# EAGLE schematic FP6120 (EAGLE 6.6.0)

## Sheet 1 of 3
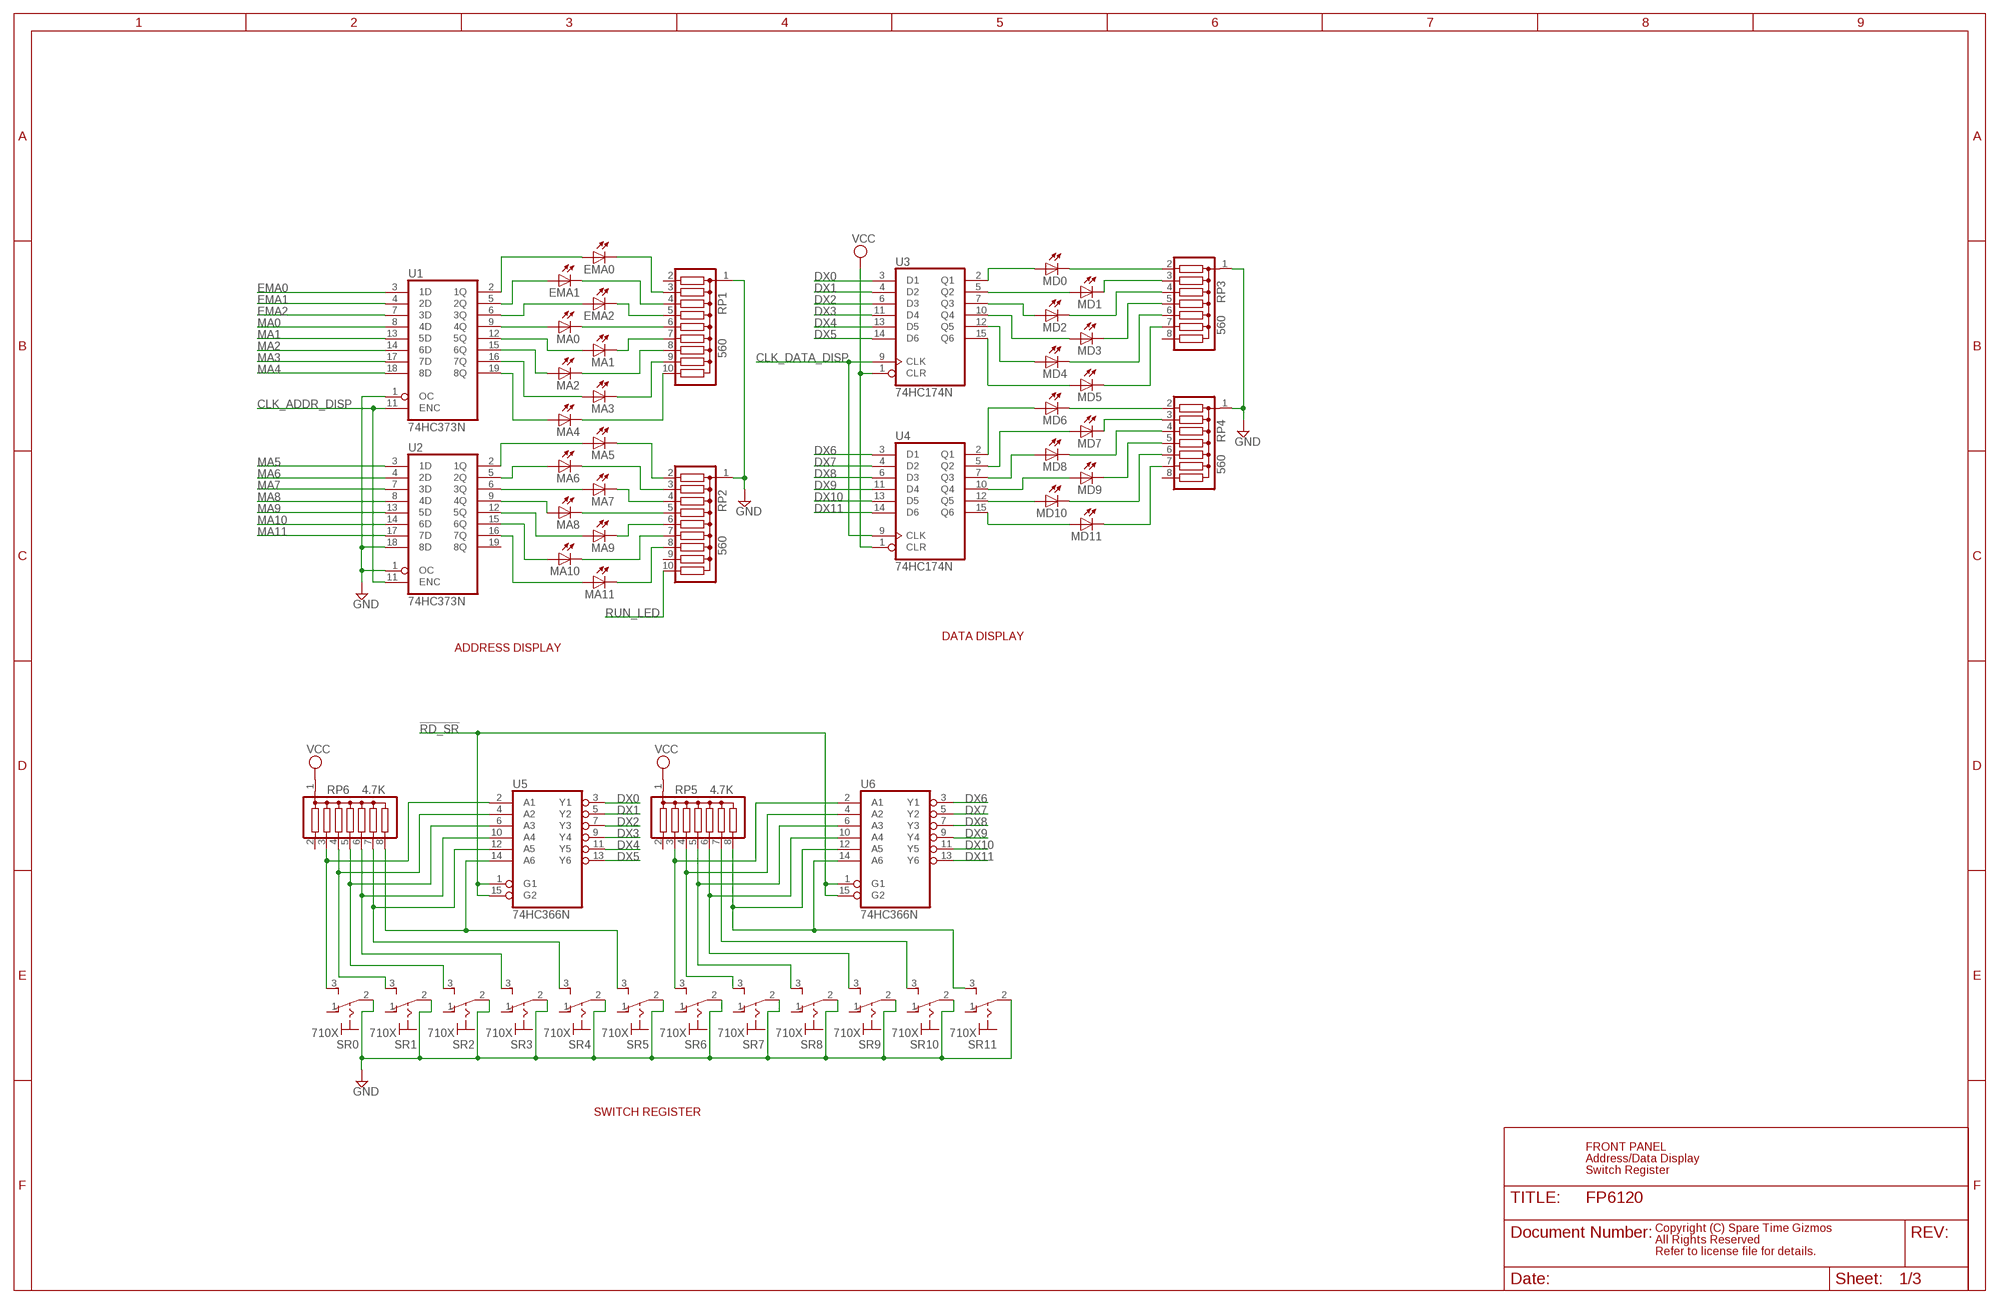
[diagram p0: schematic, sheet 1]

### Parts
EMA0  LED5MM  [LED5MM]
EMA1  LED5MM  [LED5MM]
EMA2  LED5MM  [LED5MM]
MA0  LED5MM  [LED5MM]
MA1  LED5MM  [LED5MM]
MA2  LED5MM  [LED5MM]
MA3  LED5MM  [LED5MM]
MA4  LED5MM  [LED5MM]
MA5  LED5MM  [LED5MM]
MA6  LED5MM  [LED5MM]
MA7  LED5MM  [LED5MM]
MA8  LED5MM  [LED5MM]
MA9  LED5MM  [LED5MM]
MA10  LED5MM  [LED5MM]
MA11  LED5MM  [LED5MM]
MD0  LED5MM  [LED5MM]
MD1  LED5MM  [LED5MM]
MD2  LED5MM  [LED5MM]
MD3  LED5MM  [LED5MM]
MD4  LED5MM  [LED5MM]
MD5  LED5MM  [LED5MM]
MD6  LED5MM  [LED5MM]
MD7  LED5MM  [LED5MM]
MD8  LED5MM  [LED5MM]
MD9  LED5MM  [LED5MM]
MD10  LED5MM  [LED5MM]
MD11  LED5MM  [LED5MM]
RP1  560  G09R  [SIL10]
RP2  560  G09R  [SIL10]
RP3  560  G07R  [SIL8]
RP4  560  G07R  [SIL8]
RP5  4.7K  G07R  [SIL8]
RP6  4.7K  G07R  [SIL8]
SR0  710X  [7109MD9V3]
SR1  710X  [7109MD9V3]
SR2  710X  [7109MD9V3]
SR3  710X  [7109MD9V3]
SR4  710X  [7109MD9V3]
SR5  710X  [7109MD9V3]
SR6  710X  [7109MD9V3]
SR7  710X  [7109MD9V3]
SR8  710X  [7109MD9V3]
SR9  710X  [7109MD9V3]
SR10  710X  [7109MD9V3]
SR11  710X  [7109MD9V3]
U1  74HC373N  74LS373N  [DIL20]
U2  74HC373N  74LS373N  [DIL20]
U3  74HC174N  74LS174N  [DIL16]
U4  74HC174N  74LS174N  [DIL16]
U5  74HC366N  74LS366N  [DIL16]
U6  74HC366N  74LS366N  [DIL16]

### Nets
!RD_SR: U5.1(G1) U5.15(G2) U6.1(G1) U6.15(G2) ; also sheet 3
CLK_ADDR_DISP: U1.11(ENC) U2.11(ENC) ; also sheet 2
CLK_DATA_DISP: U3.9(CLK) U4.9(CLK) ; also sheet 2
DX0: U3.3(D1) U5.3(Y1) ; also sheet 2,3
DX1: U3.4(D2) U5.5(Y2) ; also sheet 2,3
DX2: U3.6(D3) U5.7(Y3) ; also sheet 2,3
DX3: U3.11(D4) U5.9(Y4) ; also sheet 2,3
DX4: U3.13(D5) U5.11(Y5) ; also sheet 2,3
DX5: U3.14(D6) U5.13(Y6) ; also sheet 2,3
DX6: U4.3(D1) U6.3(Y1) ; also sheet 2,3
DX7: U4.4(D2) U6.5(Y2) ; also sheet 2,3
DX8: U4.6(D3) U6.7(Y3) ; also sheet 2,3
DX9: U4.11(D4) U6.9(Y4) ; also sheet 2,3
DX10: U4.13(D5) U6.11(Y5) ; also sheet 2,3
DX11: U4.14(D6) U6.13(Y6) ; also sheet 2,3
EMA0: U1.3(1D) ; also sheet 3
EMA1: U1.4(2D) ; also sheet 3
EMA2: U1.7(3D) ; also sheet 3
GND: RP1.1 RP2.1 RP3.1 RP4.1 SR0.2(P) SR1.2(P) SR2.2(P) SR3.2(P) SR4.2(P) SR5.2(P) SR6.2(P) SR7.2(P) SR8.2(P) SR9.2(P) SR10.2(P) SR11.2(P) U1.1(OC) U2.1(OC) U2.18(8D) ; also sheet 2,3
MA0: U1.8(4D) ; also sheet 3
MA1: U1.13(5D) ; also sheet 3
MA2: U1.14(6D) ; also sheet 3
MA3: U1.17(7D) ; also sheet 2,3
MA4: U1.18(8D) ; also sheet 2,3
MA5: U2.3(1D) ; also sheet 2,3
MA6: U2.4(2D) ; also sheet 2,3
MA7: U2.7(3D) ; also sheet 2,3
MA8: U2.8(4D) ; also sheet 2,3
MA9: U2.13(5D) ; also sheet 2,3
MA10: U2.14(6D) ; also sheet 2,3
MA11: U2.17(7D) ; also sheet 2,3
N$1: EMA0.A U1.2(1Q)
N$2: MA4.K(C) RP1.10
N$3: EMA1.A U1.5(2Q)
N$4: EMA2.A U1.6(3Q)
N$5: MA0.A U1.9(4Q)
N$6: MA4.A U1.19(8Q)
N$7: MA3.A U1.16(7Q)
N$8: MA2.A U1.15(6Q)
N$9: MA1.A U1.12(5Q)
N$10: MA5.A U2.2(1Q)
N$11: MA6.A U2.5(2Q)
N$12: MA7.A U2.6(3Q)
N$13: MA8.A U2.9(4Q)
N$14: MA11.A U2.16(7Q)
N$15: MA10.A U2.15(6Q)
N$16: MA9.A U2.12(5Q)
N$17: MA3.K(C) RP1.9
N$18: MA2.K(C) RP1.8
N$19: MA1.K(C) RP1.7
N$20: MA0.K(C) RP1.6
N$21: EMA0.K(C) RP1.3
N$22: EMA1.K(C) RP1.4
N$23: EMA2.K(C) RP1.5
N$24: MA11.K(C) RP2.8
N$25: MA10.K(C) RP2.7
N$26: MA9.K(C) RP2.6
N$27: MA8.K(C) RP2.5
N$28: MA7.K(C) RP2.4
N$29: MA6.K(C) RP2.3
N$30: MA5.K(C) RP2.2
N$31: MD10.A U4.12(Q5)
N$32: MD3.A U3.10(Q4)
N$33: MD1.A U3.5(Q2)
N$34: MD5.A U3.15(Q6)
N$35: MD7.A U4.5(Q2)
N$36: MD11.A U4.15(Q6)
N$37: MD9.A U4.10(Q4)
N$38: MD4.K(C) RP3.6
N$39: MD2.K(C) RP3.4
N$40: MD0.K(C) RP3.2
N$41: MD10.K(C) RP4.6
N$42: MD8.K(C) RP4.4
N$43: MD6.K(C) RP4.2
N$44: MD8.A U4.7(Q3)
N$45: MD6.A U4.2(Q1)
N$46: MD4.A U3.12(Q5)
N$47: MD2.A U3.7(Q3)
N$48: RP6.3 SR0.3(S) U5.2(A1)
N$49: MD1.K(C) RP3.3
N$50: MD3.K(C) RP3.5
N$51: MD5.K(C) RP3.7
N$52: MD7.K(C) RP4.3
N$53: MD9.K(C) RP4.5
N$54: RP6.4 SR1.3(S) U5.4(A2)
N$55: MD11.K(C) RP4.7
N$56: RP6.5 SR2.3(S) U5.6(A3)
N$57: RP6.6 SR3.3(S) U5.10(A4)
N$58: RP6.7 SR4.3(S) U5.12(A5)
N$59: RP6.8 SR5.3(S) U5.14(A6)
N$60: RP5.3 SR6.3(S) U6.2(A1)
N$61: RP5.8 SR11.3(S) U6.12(A5) U6.14(A6)
N$62: RP5.7 SR10.3(S)
N$63: RP5.6 SR9.3(S) U6.10(A4)
N$64: RP5.5 SR8.3(S) U6.6(A3)
N$65: RP5.4 SR7.3(S) U6.4(A2)
N$68: MD0.A U3.2(Q1)
RUN_LED: RP2.10 ; also sheet 2
VCC: RP5.1 RP6.1 U3.1(CLR) U4.1(CLR) ; also sheet 2,3
Unconnected: RP1.2 RP2.9 RP3.8 RP4.8 RP5.2 RP6.2 SR0.1(O) SR1.1(O) SR2.1(O) SR3.1(O) SR4.1(O) SR5.1(O) SR6.1(O) SR7.1(O) SR8.1(O) SR9.1(O) SR10.1(O) SR11.1(O) U2.19(8Q)

### Notes on the sheet
- DATA DISPLAY
- ADDRESS DISPLAY
- SWITCH REGISTER
- FRONT PANEL
- Address/Data Display
- Switch Register
- Copyright (C) Spare Time Gizmos
- All Rights Reserved
- Refer to license file for details.

## Sheet 2 of 3
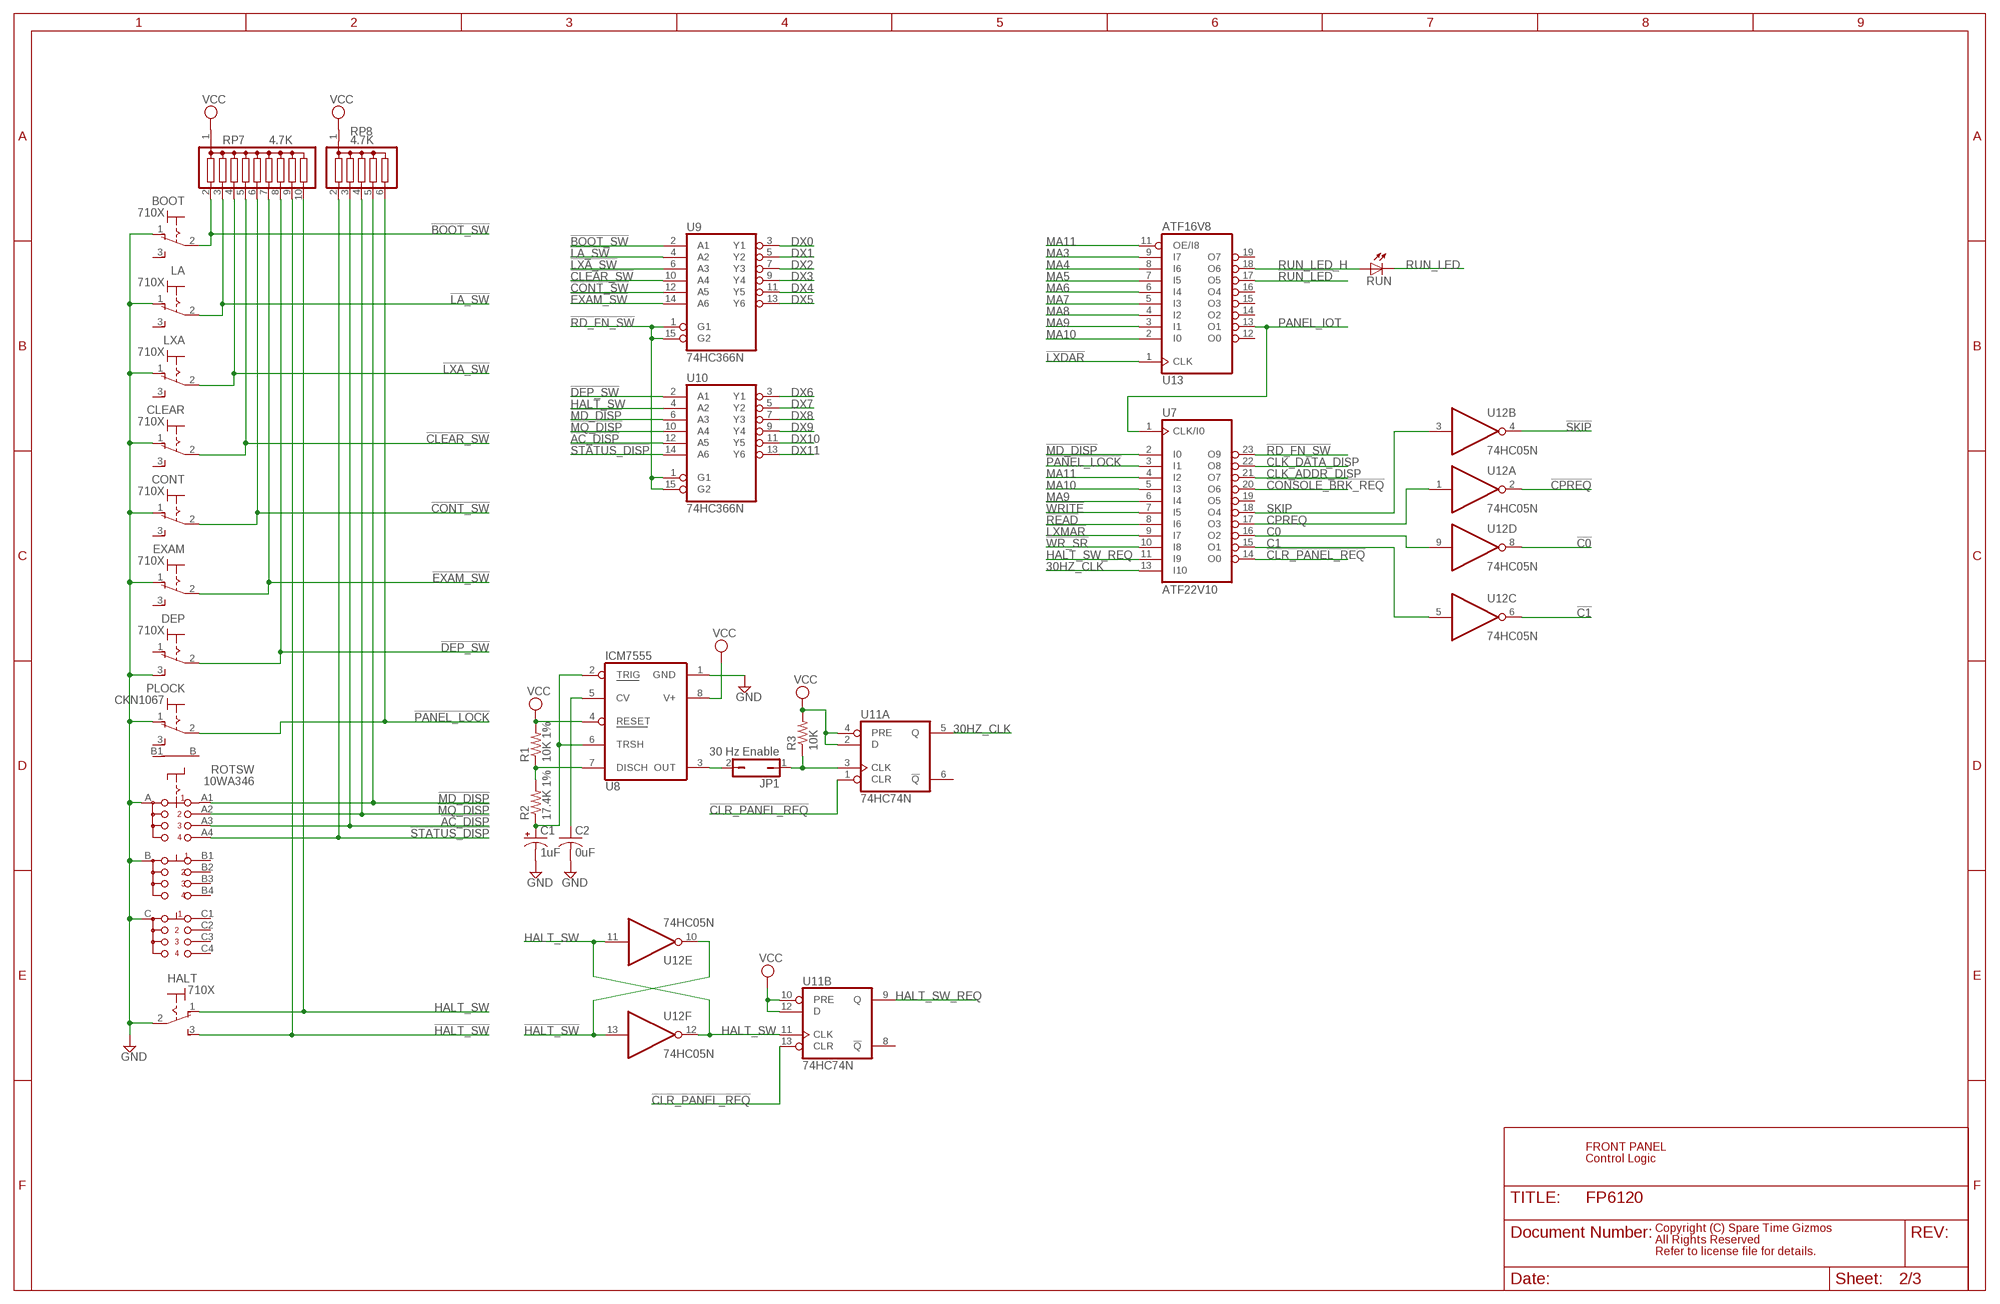
[diagram p1: schematic, sheet 2]

### Parts
BOOT  710X  [7109MD9V3]
C1  1uF  CPOL-USB45181A  [B45181A]
C2  0uF  C-US050-024X044  [C050-024X044]
CLEAR  710X  [7109MD9V3]
CONT  710X  [7109MD9V3]
DEP  710X  [7109MD9V3]
EXAM  710X  [7109MD9V3]
HALT  710X  [7109MD9V3]
JP1  30 Hz Enable  JP1Q  [JP1]
LA  710X  [7109MD9V3]
LXA  710X  [7109MD9V3]
PLOCK  CKN1067  9070-1W  [9070-1W]
R1  10K 1%  R-US_0204/7  [0204/7]
R2  17.4K 1%  R-US_0204/7  [0204/7]
R3  10K  R-US_0204/7  [0204/7]
ROTSW  10WA346  CK103X04  [CK103X04]
RP7  4.7K  G09R  [SIL10]
RP8  4.7K  G05R  [SIL6]
RUN  LED5MM  [LED5MM]
U7  ATF22V10  22V10  [DIL24-3]
U8  ICM7555  [DIL08]
U9  74HC366N  74LS366N  [DIL16]
U10  74HC366N  74LS366N  [DIL16]
U11  74HC74N  74LS74N  [DIL14]
U12  74HC05N  74LS05N  [DIL14]
U13  ATF16V8  16V8  [DIL20]

### Nets
30HZ_CLK: U7.13(I10) U11.5(A:Q)
!AC_DISP: ROTSW.A3 RP8.3 U10.12(A5)
!BOOT_SW: BOOT.2(P) RP7.2 U9.2(A1)
!C0: U12.8(D:O) ; also sheet 3
!C1: U12.6(C:O) ; also sheet 3
!CLEAR_SW: CLEAR.2(P) RP7.5 U9.10(A4)
!CLR_PANEL_REQ: U7.14(O0) U11.1(A:CLR) U11.13(B:CLR)
!CONSOLE_BRK_REQ: U7.20(O6) ; also sheet 3
!CONT_SW: CONT.2(P) RP7.6 U9.12(A5)
!CPREQ: U12.2(A:O) ; also sheet 3
!DEP_SW: DEP.2(P) RP7.8 U10.2(A1)
!EXAM_SW: EXAM.2(P) RP7.7 U9.14(A6)
!HALT_SW: HALT.3(S) RP7.9 U12.10(E:O) U12.13(F:I)
!LA_SW: LA.2(P) RP7.3 U9.4(A2)
!LXA_SW: LXA.2(P) RP7.4 U9.6(A3)
!LXDAR: U13.1(CLK) ; also sheet 3
!LXMAR: U7.9(I7) ; also sheet 3
!MD_DISP: ROTSW.A1 RP8.5 U7.2(I0) U10.6(A3)
!MQ_DISP: ROTSW.A2 RP8.4 U10.10(A4)
!PANEL_LOCK: PLOCK.2(P) RP8.6 U7.3(I1)
!RD_FN_SW: U7.23(O9) U9.1(G1) U9.15(G2) U10.1(G1) U10.15(G2)
!READ: U7.8(I6) ; also sheet 3
!RUN_LED: U13.17(O5)
!SKIP: U12.4(B:O) ; also sheet 3
!STATUS_DISP: ROTSW.A4 RP8.2 U10.14(A6)
!WR_SR: U7.10(I8) ; also sheet 3
!WRITE: U7.7(I5) ; also sheet 3
C0: U7.16(O2) U12.9(D:I)
C1: U7.15(O1) U12.5(C:I)
CLK_ADDR_DISP: U7.21(O7) ; also sheet 1
CLK_DATA_DISP: U7.22(O8) ; also sheet 1
CPREQ: U7.17(O3) U12.1(A:I)
DX0: U9.3(Y1) ; also sheet 1,3
DX1: U9.5(Y2) ; also sheet 1,3
DX2: U9.7(Y3) ; also sheet 1,3
DX3: U9.9(Y4) ; also sheet 1,3
DX4: U9.11(Y5) ; also sheet 1,3
DX5: U9.13(Y6) ; also sheet 1,3
DX6: U10.3(Y1) ; also sheet 1,3
DX7: U10.5(Y2) ; also sheet 1,3
DX8: U10.7(Y3) ; also sheet 1,3
DX9: U10.9(Y4) ; also sheet 1,3
DX10: U10.11(Y5) ; also sheet 1,3
DX11: U10.13(Y6) ; also sheet 1,3
GND: BOOT.1(O) C1.- C2.2 CLEAR.1(O) CONT.1(O) DEP.3(S) EXAM.1(O) HALT.2(P) LA.1(O) LXA.1(O) PLOCK.1(O) ROTSW.A ROTSW.B ROTSW.C U8.1(GND) ; also sheet 1,3
HALT_SW: HALT.1(O) RP7.10 U10.4(A2) U11.11(B:CLK) U12.11(E:I) U12.12(F:O)
HALT_SW_REQ: U7.11(I9) U11.9(B:Q)
MA3: U13.9(I7) ; also sheet 1,3
MA4: U13.8(I6) ; also sheet 1,3
MA5: U13.7(I5) ; also sheet 1,3
MA6: U13.6(I4) ; also sheet 1,3
MA7: U13.5(I3) ; also sheet 1,3
MA8: U13.4(I2) ; also sheet 1,3
MA9: U7.6(I4) U13.3(I1) ; also sheet 1,3
MA10: U7.5(I3) U13.2(I0) ; also sheet 1,3
MA11: U7.4(I2) U13.11(OE/I8) ; also sheet 1,3
N$66: JP1.2 U8.3(OUT)
N$67: JP1.1 R3.1 U11.3(A:CLK)
N$69: R1.1 R2.2 U8.7(DISCH)
N$70: C1.+ R2.1 U8.2(TRIG) U8.6(TRSH)
N$71: C2.1 U8.5(CV)
PANEL_IOT: U7.1(CLK/I0) U13.13(O1) ; also sheet 3
RUN_LED: RUN.K(C) ; also sheet 1
RUN_LED_H: RUN.A U13.18(O6)
SKIP: U7.18(O4) U12.3(B:I) ; also sheet 3
VCC: R1.2 R3.2 RP7.1 RP8.1 U8.4(RESET) U8.8(V+) U11.2(A:D) U11.4(A:PRE) U11.10(B:PRE) U11.12(B:D) ; also sheet 1,3
Unconnected: BOOT.3(S) CLEAR.3(S) CONT.3(S) DEP.1(O) EXAM.3(S) LA.3(S) LXA.3(S) PLOCK.3(S) PLOCK.B PLOCK.B1 ROTSW.B1 ROTSW.B2 ROTSW.B3 ROTSW.B4 ROTSW.C1 ROTSW.C2 ROTSW.C3 ROTSW.C4 U7.19(O5) U11.6(A:!Q) U11.8(B:!Q) U13.12(O0) U13.14(O2) U13.15(O3) U13.16(O4) U13.19(O7)

### Notes on the sheet
- FRONT PANEL
- Control Logic
- Copyright (C) Spare Time Gizmos
- All Rights Reserved
- Refer to license file for details.

## Sheet 3 of 3
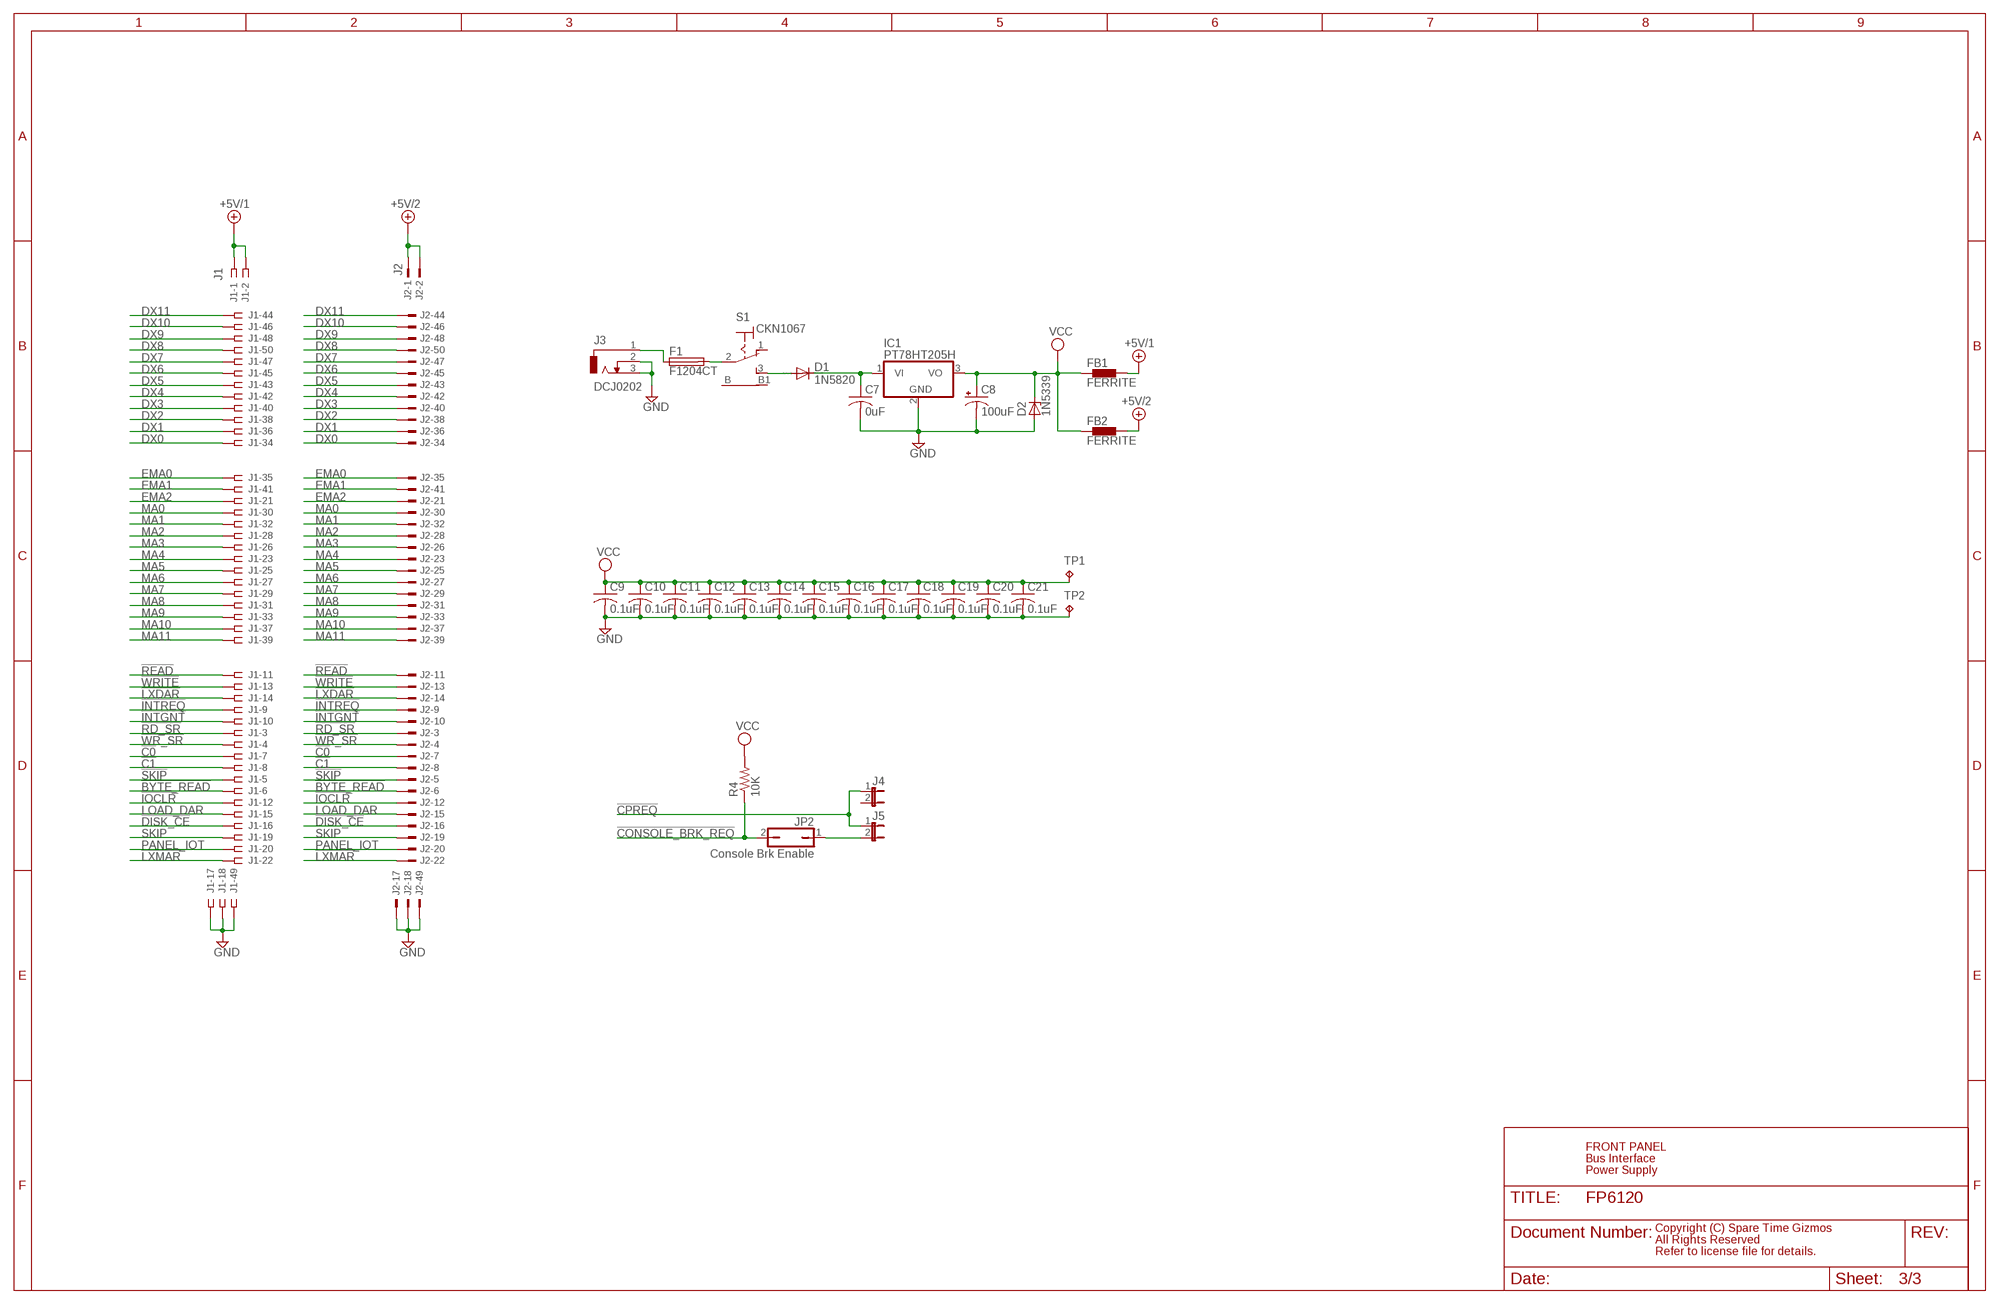
[diagram p2: schematic, sheet 3]

### Parts
C7  0uF  C-US050-024X044  [C050-024X044]
C8  100uF  CPOL-USB45181A  [B45181A]
C9  0.1uF  C-US025-025X050  [C025-025X050]
C10  0.1uF  C-US025-025X050  [C025-025X050]
C11  0.1uF  C-US025-025X050  [C025-025X050]
C12  0.1uF  C-US025-025X050  [C025-025X050]
C13  0.1uF  C-US025-025X050  [C025-025X050]
C14  0.1uF  C-US025-025X050  [C025-025X050]
C15  0.1uF  C-US025-025X050  [C025-025X050]
C16  0.1uF  C-US025-025X050  [C025-025X050]
C17  0.1uF  C-US025-025X050  [C025-025X050]
C18  0.1uF  C-US025-025X050  [C025-025X050]
C19  0.1uF  C-US025-025X050  [C025-025X050]
C20  0.1uF  C-US025-025X050  [C025-025X050]
C21  0.1uF  C-US025-025X050  [C025-025X050]
D1  1N5820  DIODE-SOD61B  [SOD61B]
D2  1N5339  ZENER-DIODEZD-12.5  [ZDIO12.5]
F1  F1204CT  PICOFUSE  [PICOFUSE]
FB1  FERRITE  BL01RN1A  [BL01RN1A]
FB2  FERRITE  BL01RN1A  [BL01RN1A]
IC1  PT78HT205H  7805T  [TO220H]
J1  J1  SSW-125-02-S-D  [SSW-125-02-S-D]
J2  J2  TSW-125-02-S-D  [TSW-125-02-S-D]
J3  DCJ0202  [DCJ0202]
J4  JP1E  [JP1]
J5  JP1E  [JP1]
JP2  Console Brk Enable  JP1Q  [JP1]
R4  10K  R-US_0204/7  [0204/7]
S1  CKN1067  9070-1W  [9070-1W]
TP1  TPPAD1-20Y  [P1-20Y]
TP2  TPPAD1-20Y  [P1-20Y]

### Nets
!BYTE_READ: J1.6 J2.6
!C0: J1.7 J2.7 ; also sheet 2
!C1: J1.8 J2.8 ; also sheet 2
!CONSOLE_BRK_REQ: JP2.2 R4.1 ; also sheet 2
!CPREQ: J4.1 J5.1 ; also sheet 2
!DISK_CE: J1.16 J2.16
!INTGNT: J1.10 J2.10
!INTREQ: J1.9 J2.9
!IOCLR: J1.12 J2.12
!LXDAR: J1.14 J2.14 ; also sheet 2
!LXMAR: J1.22 J2.22 ; also sheet 2
!RD_SR: J1.3 J2.3 ; also sheet 1
!READ: J1.11 J2.11 ; also sheet 2
!SKIP: J1.5 J2.5 ; also sheet 2
!WR_SR: J1.4 J2.4 ; also sheet 2
!WRITE: J1.13 J2.13 ; also sheet 2
+5V/1: FB1.2 J1.1 J1.2
+5V/2: FB2.2 J2.1 J2.2
DX0: J1.34 J2.34 ; also sheet 1,2
DX1: J1.36 J2.36 ; also sheet 1,2
DX2: J1.38 J2.38 ; also sheet 1,2
DX3: J1.40 J2.40 ; also sheet 1,2
DX4: J1.42 J2.42 ; also sheet 1,2
DX5: J1.43 J2.43 ; also sheet 1,2
DX6: J1.45 J2.45 ; also sheet 1,2
DX7: J1.47 J2.47 ; also sheet 1,2
DX8: J1.50 J2.50 ; also sheet 1,2
DX9: J1.48 J2.48 ; also sheet 1,2
DX10: J1.46 J2.46 ; also sheet 1,2
DX11: J1.44 J2.44 ; also sheet 1,2
EMA0: J1.35 J2.35 ; also sheet 1
EMA1: J1.41 J2.41 ; also sheet 1
EMA2: J1.21 J2.21 ; also sheet 1
GND: C7.2 C8.- C9.2 C10.2 C11.2 C12.2 C13.2 C14.2 C15.2 C16.2 C17.2 C18.2 C19.2 C20.2 C21.2 D2.A IC1.2(GND) J1.17 J1.18 J1.49 J2.17 J2.18 J2.49 J3.2 J3.3 TP2.TP ; also sheet 1,2
LOAD_DAR: J1.15 J2.15
MA0: J1.30 J2.30 ; also sheet 1
MA1: J1.32 J2.32 ; also sheet 1
MA2: J1.28 J2.28 ; also sheet 1
MA3: J1.26 J2.26 ; also sheet 1,2
MA4: J1.23 J2.23 ; also sheet 1,2
MA5: J1.25 J2.25 ; also sheet 1,2
MA6: J1.27 J2.27 ; also sheet 1,2
MA7: J1.29 J2.29 ; also sheet 1,2
MA8: J1.31 J2.31 ; also sheet 1,2
MA9: J1.33 J2.33 ; also sheet 1,2
MA10: J1.37 J2.37 ; also sheet 1,2
MA11: J1.39 J2.39 ; also sheet 1,2
N$72: D1.A S1.3(S)
N$73: C7.1 D1.C IC1.1(VI)
N$74: F1.2 S1.2(P)
N$76: F1.1 J3.1
N$77: J5.2 JP2.1
PANEL_IOT: J1.20 J2.20 ; also sheet 2
SKIP: J1.19 J2.19 ; also sheet 2
VCC: C8.+ C9.1 C10.1 C11.1 C12.1 C13.1 C14.1 C15.1 C16.1 C17.1 C18.1 C19.1 C20.1 C21.1 D2.C FB1.1 FB2.1 IC1.3(VO) R4.2 TP1.TP ; also sheet 1,2
Unconnected: J1.24 J2.24 J4.2 S1.1(O) S1.B S1.B1

### Notes on the sheet
- FRONT PANEL
- Bus Interface
- Power Supply
- Copyright (C) Spare Time Gizmos
- All Rights Reserved
- Refer to license file for details.

## Power pins joined to a net without a drawn wire
GND: BOOT.NC@1(GND) BOOT.NC@2(GND) BOOT.NC@3(GND) BOOT.NC@4(GND) BOOT.NC@5(GND) BOOT.NC@6(GND) BOOT.NC@7(GND) BOOT.NC@8(GND) CLEAR.NC@1(GND) CLEAR.NC@2(GND) CLEAR.NC@3(GND) CLEAR.NC@4(GND) CLEAR.NC@5(GND) CLEAR.NC@6(GND) CLEAR.NC@7(GND) CLEAR.NC@8(GND) CONT.NC@1(GND) CONT.NC@2(GND) CONT.NC@3(GND) CONT.NC@4(GND) CONT.NC@5(GND) CONT.NC@6(GND) CONT.NC@7(GND) CONT.NC@8(GND) DEP.NC@1(GND) DEP.NC@2(GND) DEP.NC@3(GND) DEP.NC@4(GND) DEP.NC@5(GND) DEP.NC@6(GND) DEP.NC@7(GND) DEP.NC@8(GND) EXAM.NC@1(GND) EXAM.NC@2(GND) EXAM.NC@3(GND) EXAM.NC@4(GND) EXAM.NC@5(GND) EXAM.NC@6(GND) EXAM.NC@7(GND) EXAM.NC@8(GND) HALT.NC@1(GND) HALT.NC@2(GND) HALT.NC@3(GND) HALT.NC@4(GND) HALT.NC@5(GND) HALT.NC@6(GND) HALT.NC@7(GND) HALT.NC@8(GND) LA.NC@1(GND) LA.NC@2(GND) LA.NC@3(GND) LA.NC@4(GND) LA.NC@5(GND) LA.NC@6(GND) LA.NC@7(GND) LA.NC@8(GND) LXA.NC@1(GND) LXA.NC@2(GND) LXA.NC@3(GND) LXA.NC@4(GND) LXA.NC@5(GND) LXA.NC@6(GND) LXA.NC@7(GND) LXA.NC@8(GND) SR0.NC@1(GND) SR0.NC@2(GND) SR0.NC@3(GND) SR0.NC@4(GND) SR0.NC@5(GND) SR0.NC@6(GND) SR0.NC@7(GND) SR0.NC@8(GND) SR1.NC@1(GND) SR1.NC@2(GND) SR1.NC@3(GND) SR1.NC@4(GND) SR1.NC@5(GND) SR1.NC@6(GND) SR1.NC@7(GND) SR1.NC@8(GND) SR2.NC@1(GND) SR2.NC@2(GND) SR2.NC@3(GND) SR2.NC@4(GND) SR2.NC@5(GND) SR2.NC@6(GND) SR2.NC@7(GND) SR2.NC@8(GND) SR3.NC@1(GND) SR3.NC@2(GND) SR3.NC@3(GND) SR3.NC@4(GND) SR3.NC@5(GND) SR3.NC@6(GND) SR3.NC@7(GND) SR3.NC@8(GND) SR4.NC@1(GND) SR4.NC@2(GND) SR4.NC@3(GND) SR4.NC@4(GND) SR4.NC@5(GND) SR4.NC@6(GND) SR4.NC@7(GND) SR4.NC@8(GND) SR5.NC@1(GND) SR5.NC@2(GND) SR5.NC@3(GND) SR5.NC@4(GND) SR5.NC@5(GND) SR5.NC@6(GND) SR5.NC@7(GND) SR5.NC@8(GND) SR6.NC@1(GND) SR6.NC@2(GND) SR6.NC@3(GND) SR6.NC@4(GND) SR6.NC@5(GND) SR6.NC@6(GND) SR6.NC@7(GND) SR6.NC@8(GND) SR7.NC@1(GND) SR7.NC@2(GND) SR7.NC@3(GND) SR7.NC@4(GND) SR7.NC@5(GND) SR7.NC@6(GND) SR7.NC@7(GND) SR7.NC@8(GND) SR8.NC@1(GND) SR8.NC@2(GND) SR8.NC@3(GND) SR8.NC@4(GND) SR8.NC@5(GND) SR8.NC@6(GND) SR8.NC@7(GND) SR8.NC@8(GND) SR9.NC@1(GND) SR9.NC@2(GND) SR9.NC@3(GND) SR9.NC@4(GND) SR9.NC@5(GND) SR9.NC@6(GND) SR9.NC@7(GND) SR9.NC@8(GND) SR10.NC@1(GND) SR10.NC@2(GND) SR10.NC@3(GND) SR10.NC@4(GND) SR10.NC@5(GND) SR10.NC@6(GND) SR10.NC@7(GND) SR10.NC@8(GND) SR11.NC@1(GND) SR11.NC@2(GND) SR11.NC@3(GND) SR11.NC@4(GND) SR11.NC@5(GND) SR11.NC@6(GND) SR11.NC@7(GND) SR11.NC@8(GND) U1.10(GND) U2.10(GND) U3.8(GND) U4.8(GND) U5.8(GND) U6.8(GND) U7.12(GND) U9.8(GND) U10.8(GND) U11.7(P:GND) U12.7(P:GND) U13.10(GND)
VCC: U1.20(VCC) U2.20(VCC) U3.16(VCC) U4.16(VCC) U5.16(VCC) U6.16(VCC) U7.24(VCC) U9.16(VCC) U10.16(VCC) U11.14(P:VCC) U12.14(P:VCC) U13.20(VCC)

## Library data of the parts
BOOT CLEAR CONT DEP EXAM HALT LA LXA SR0 SR1-SR11 = dec-con:710X: 710x with optional V2 or V3 mounting bracket.
C1 C8 = rcl:CPOL-US: POLARIZED CAPACITOR, American symbol
C2 C7 C9-C21 = rcl:C-US: CAPACITOR, American symbol
D1 = diode:DIODE-: DIODE
D2 = diode:ZENER-DIODE: Z-Diode
EMA0 EMA1 EMA2 MA0 MA1-MA11 MD0 MD1-MD11 RUN = led:LED: LED OSRAM: - CHIPLED LG R971, LG N971, LY N971, LG Q971, LY Q971, LO R971, LY R971 LH N974, LH R974 LS Q976, LO Q976, LY Q976 LO Q996 - Hyper CHIPLED LW Q18S LB Q993, LB Q99A, LB R99A - SideLED LS A670, LO A670, LY A670, LG A670, LP A670 LB A673, LV A673, LT A673, LW A673 LH A674 LY A675 LS A676, LA A676, LO A676, LY A676, LW A676 LS A679, LY A679, LG A679 - Hyper Micro SIDELED® LS Y876, LA Y876, LO Y876, LY Y876 LT Y87S - SmartLED LW L88C, LW L88S LB L89C, LB L89S, LG L890 LS L89K, LO L89K, LY L89K LS L896, LA L896, LO L896, LY L896 - TOPLED LS T670, LO T670, LY T670, LG T670, LP T670 LSG T670, LSP T670, LSY T670, LOP T670, LYG T670 LG T671, LOG T671, LSG T671 LB T673, LV T673, LT T673, LW T673 LH T674 LS T676, LA T676, LO T676, LY T676, LB T676, LH T676, LSB T676, LW T676 LB T67C, LV T67C, LT T67C, LS T67K, LO T67K, LY T67K, LW E67C LS E67B, LA E67B, LO E67B, LY E67B, LB E67C, LV E67C, LT E67C LW T67C LS T679, LY T679, LG T679 LS T770, LO T770, LY T770, LG T770, LP T770 LB T773, LV T773, LT T773, LW T773 LH T774 LS E675, LA E675, LY E675, LS T675 LS T776, LA T776, LO T776, LY T776, LB T776 LHGB T686 LT T68C, LB T68C - Hyper Mini TOPLED® LB M676 - Mini TOPLED Santana® LG M470 LS M47K, LO M47K, LY M47K Source: http://www.osram.convergy.de LUXEON: - LUMILED® LXK2-PW12-R00, LXK2-PW12-S00, LXK2-PW14-U00, LXK2-PW14-V00 LXK2-PM12-R00, LXK2-PM12-S00, LXK2-PM14-U00 LXK2-PE12-Q00, LXK2-PE12-R00, LXK2-PE12-S00, LXK2-PE14-T00, LXK2-PE14-U00 LXK2-PB12-K00, LXK2-PB12-L00, LXK2-PB12-M00, LXK2-PB14-N00, LXK2-PB14-P00, LXK2-PB14-Q00 LXK2-PR12-L00, LXK2-PR12-M00, LXK2-PR14-Q00, LXK2-PR14-R00 LXK2-PD12-Q00, LXK2-PD12-R00, LXK2-PD12-S00 LXK2-PH12-R00, LXK2-PH12-S00 LXK2-PL12-P00, LXK2-PL12-Q00, LXK2-PL12-R00 Source: www.luxeon.com KINGBRIGHT: KA-3528ASYC Source: www.kingbright.com
F1 = fuse:PICOFUSE: PICOFUSE 19275, Wickmann; OC_FARNELL: unknown; OC_NEWARK: unknown
FB1 FB2 = inductors:BL0: Noise Suppression Products/EMI Suppression Filters, Lead EMIFIL(R) Inductor Type Source: http://www.murata.com .. BL01RN1_DS.pdf
IC1 = linear:78*: Positive VOLTAGE REGULATOR Source: http://cache.national.com/ds/LM/LM78L05.pdf http://www.fairchildsemi.com/ds/LM/LM7805.pdf
J1 = con-samtec:SSW-125-02-S-D: THROUGH-HOLE .025" SQ POST SOCKET Source: Samtec SSW.pdf; MPN: SSW-125-02-S-D; OC_FARNELL: unknown; OC_NEWARK: 11P9723
J2 = con-samtec:TSW-125-02-S-D: THROUGH-HOLE .025" SQ POST HEADER Source: Samtec TSW.pdf; OC_FARNELL: unknown; OC_NEWARK: unknown
J3 = con-jack:DCJ0202: DC POWER JACK Source: DCJ0202.pdf; OC_FARNELL: unknown; OC_NEWARK: unknown
J4 J5 = jumper:JP1E: JUMPER
JP1 JP2 = jumper:JP1Q: JUMPER
PLOCK S1 = switch:9070-1W: TOGGLE SWITCH Marquardt
R1-R4 = rcl:R-US_: RESISTOR, American symbol
ROTSW = switch:CK103X04: ROTARY SWITCH C&K
RP1 RP2 RP7 = resistor-sil:G09R: SIL RESISTOR; OC_FARNELL: unknown; OC_NEWARK: unknown
RP3-RP6 = resistor-sil:G07R: SIL RESISTOR; OC_FARNELL: unknown; OC_NEWARK: unknown
RP8 = resistor-sil:G05R: SIL RESISTOR; OC_FARNELL: unknown; OC_NEWARK: unknown
TP1 TP2 = testpad:TP: Test pad
U1 U2 = 74xx-us:74*373: Octal D type transparent LATCH, edge triggered
U3 U4 = 74xx-us:74*174: Hex D type FLIP FLOP, clear
U5 U6 U9 U10 = 74xx-us:74*366: Hex BUS DRIVER, 3-state
U7 = pal:22V10: PAL; MPN: GAL22V10D-7LPN; OC_FARNELL: 1571925; OC_NEWARK: 97M0480
U8 = maxim:ICM7555: TIMER; MF: MAXIM; MPN: ICM7555IPA+; OC_FARNELL: 9663762; OC_NEWARK: 68K4387
U11 = 74xx-us:74*74: Dual D type positive edge triggered FLIP FLOP, preset and clear
U12 = 74xx-us:74*05: Hex INVERTER, open collector
U13 = pal:16V8: PAL; MPN: GAL16V8D-7LPN; OC_FARNELL: 9699740; OC_NEWARK: 97K0449